# EAGLE design Emoji Board (EAGLE 7.5.0)
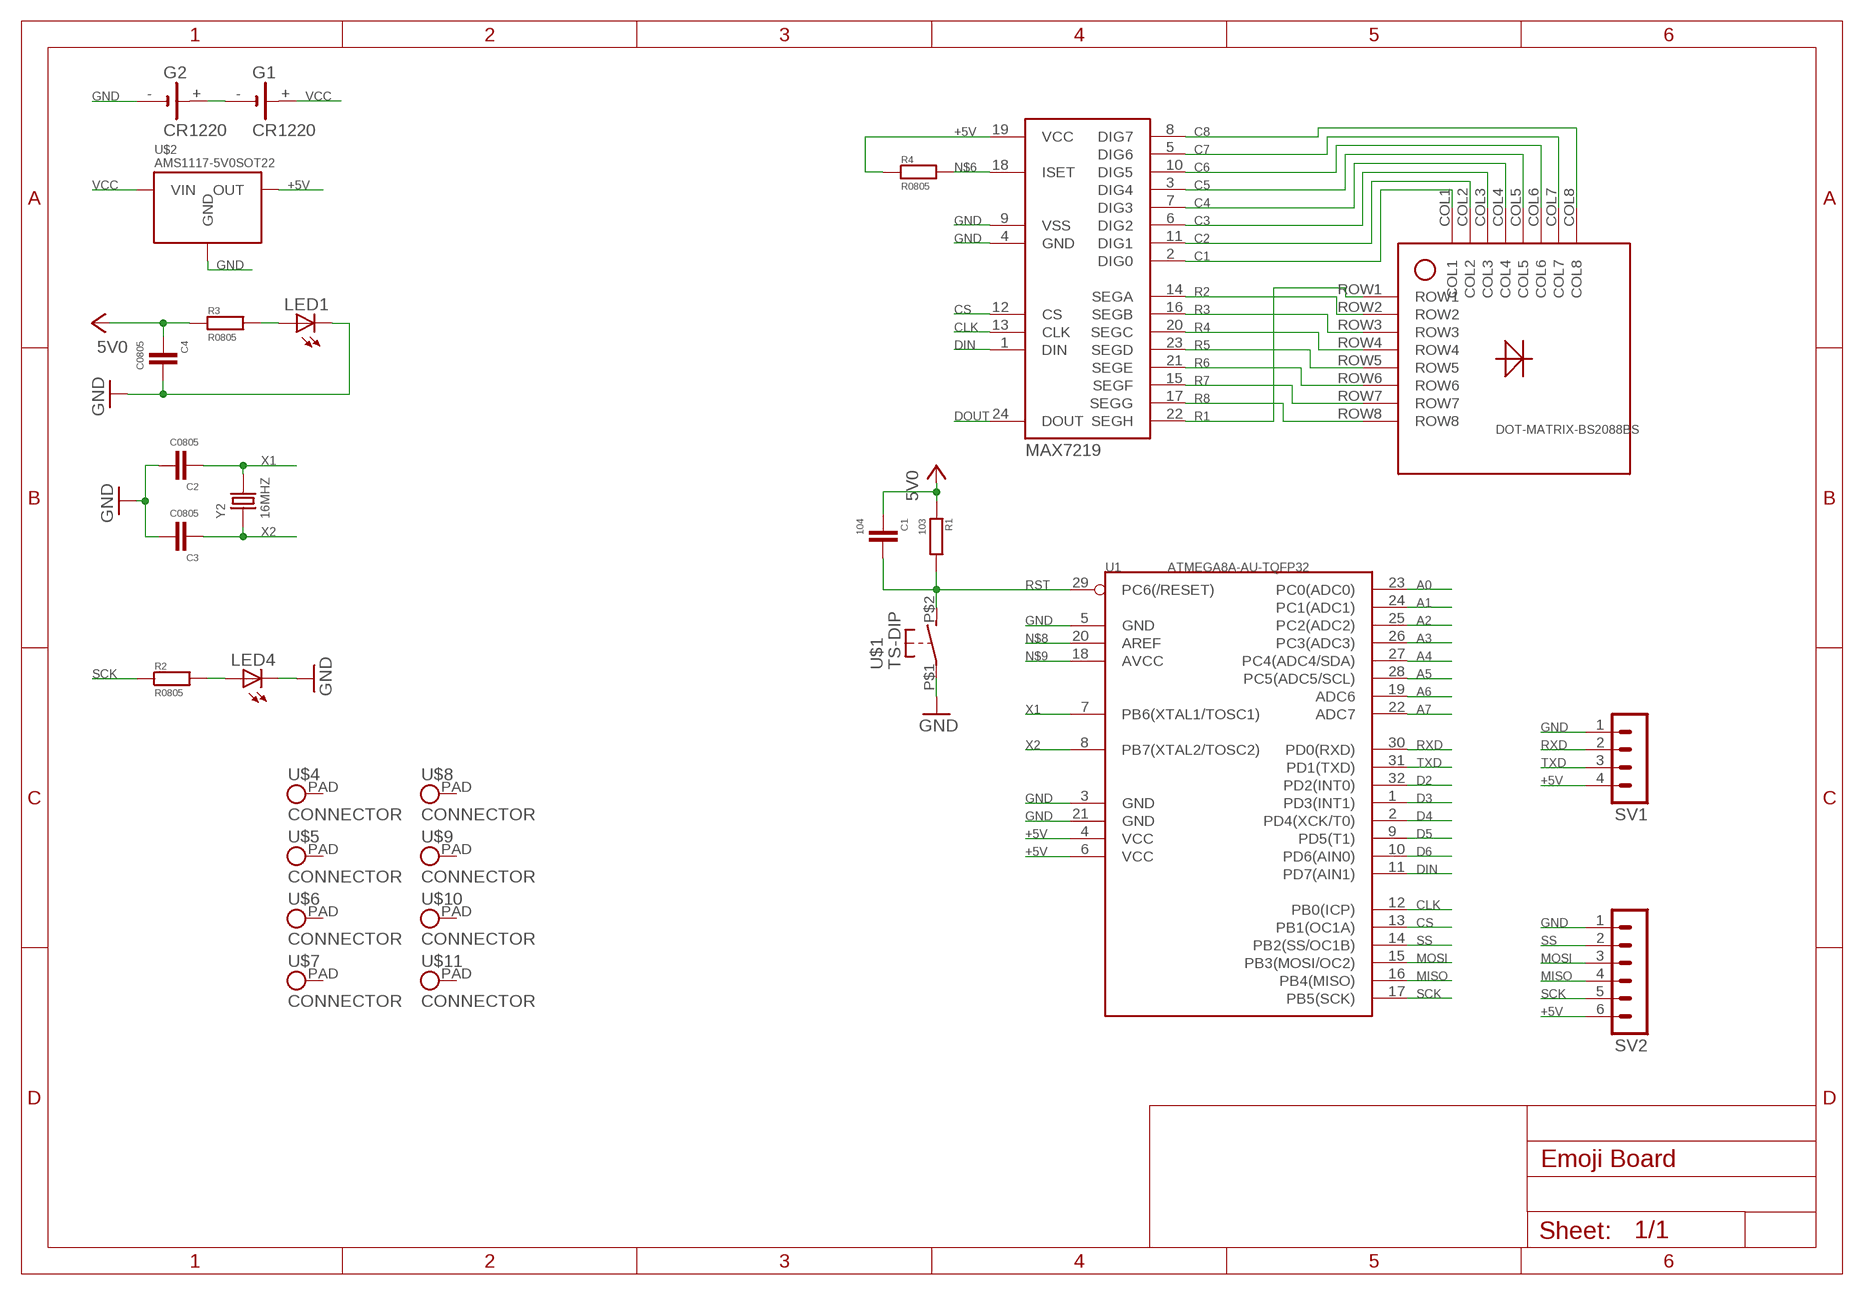
[diagram p0: schematic, sheet 1]

## Parts
C1  104  C0805  [C0805]
C2  C0805  [C0805]
C3  C0805  [C0805]
C4  C0805  [C0805]
G1  CR1220  [CR1220]
G2  CR1220  [CR1220]
LED1  LEDSML0805  [SML0805]
LED4  LEDSML0805  [SML0805]
R1  103  R0805  [R0805]
R2  R0805  [R0805]
R3  R0805  [R0805]
R4  R0805  [R0805]
SV1  MA04-1  [MA04-1]
SV2  MA06-1  [MA06-1]
U1  ATMEGA8A-AU-TQFP32  ATMEGA8A-AU  [TQFP32]
U$1  TS-DIP  [TS-DIP]
U$2  AMS1117-5V0SOT22  [SOT223]
U$3  DOT-MATRIX-BS2088BS  [2088BS]
U$4  CONNECTOR  [PAD]
U$5  CONNECTOR  [PAD]
U$6  CONNECTOR  [PAD]
U$7  CONNECTOR  [PAD]
U$8  CONNECTOR  [PAD]
U$9  CONNECTOR  [PAD]
U$10  CONNECTOR  [PAD]
U$11  CONNECTOR  [PAD]
U$12  MAX7219  [SOP24]
Y2  16MHZ  DIP-CRYSTAL-16MHZ-18PF-30PPM-40R(HC49US)  [HC49US]

## Nets
+5V: C1.2 C4.2 R1.1 R3.1 R4.1 SV1.4 SV2.6 U1.4(VCC) U1.6(VCC) U$2.OUT U$12.19(VCC) ; supply symbol labelled 5V0
A0: U1.23(PC0(ADC0))
A1: U1.24(PC1(ADC1))
A2: U1.25(PC2(ADC2))
A3: U1.26(PC3(ADC3))
A4: U1.27(PC4(ADC4/SDA))
A5: U1.28(PC5(ADC5/SCL))
A6: U1.19(ADC6)
A7: U1.22(ADC7)
C1: U$3.COL1 U$12.2(DIG0)
C2: U$3.COL2 U$12.11(DIG1)
C3: U$3.COL3 U$12.6(DIG2)
C4: U$3.COL4 U$12.7(DIG3)
C5: U$3.COL5 U$12.3(DIG4)
C6: U$3.COL6 U$12.10(DIG5)
C7: U$3.COL7 U$12.5(DIG6)
C8: U$3.COL8 U$12.8(DIG7)
CLK: U1.12(PB0(ICP)) U$12.13(CLK)
CS: U1.13(PB1(OC1A)) U$12.12(CS)
D2: U1.32(PD2(INT0))
D3: U1.1(PD3(INT1))
D4: U1.2(PD4(XCK/T0))
D5: U1.9(PD5(T1))
D6: U1.10(PD6(AIN0))
DIN: U1.11(PD7(AIN1)) U$12.1(DIN)
DOUT: U$12.24(DOUT)
GND: C2.1 C3.1 C4.1 G2.- LED1.C LED4.C SV1.1 SV2.1 U1.3(GND) U1.5(GND) U1.21(GND) U$1.P$1(P) U$2.GND U$12.4(GND) U$12.9(VSS)
MISO: SV2.4 U1.16(PB4(MISO))
MOSI: SV2.3 U1.15(PB3(MOSI/OC2))
N$1: LED4.A R2.2
N$2: G1.- G2.+
N$6: R4.2 U$12.18(ISET)
N$8: U1.20(AREF)
N$9: U1.18(AVCC)
N$10: LED1.A R3.2
R1: U$3.ROW1 U$12.22(SEGH)
R2: U$3.ROW2 U$12.14(SEGA)
R3: U$3.ROW3 U$12.16(SEGB)
R4: U$3.ROW4 U$12.20(SEGC)
R5: U$3.ROW5 U$12.23(SEGD)
R6: U$3.ROW6 U$12.21(SEGE)
R7: U$3.ROW7 U$12.15(SEGF)
R8: U$3.ROW8 U$12.17(SEGG)
RST: C1.1 R1.2 U1.29(PC6(/RESET)) U$1.P$2(S)
RXD: SV1.2 U1.30(PD0(RXD))
SCK: R2.1 SV2.5 U1.17(PB5(SCK))
SS: SV2.2 U1.14(PB2(SS/OC1B))
TXD: SV1.3 U1.31(PD1(TXD))
VCC: G1.+ U$2.VIN
X1: C2.2 U1.7(PB6(XTAL1/TOSC1)) Y2.2
X2: C3.2 U1.8(PB7(XTAL2/TOSC2)) Y2.1
Unconnected: U$4.PAD U$5.PAD U$6.PAD U$7.PAD U$8.PAD U$9.PAD U$10.PAD U$11.PAD

## Library data of the parts
C1-C4 = RCLDA:C: CAPACITOR
G1 G2 = Power:CR1220: Battery Holder, SMT, 12mm multicomp PART NO. CH291-1220LF Source: Data sheet <http://www.farnell.com/datasheets/1505860.pdf>
LED1 LED4 = Display:LED
R1-R4 = RCLDA:R: RESISTOR
SV1 = Pin-Header:MA04-1: PIN HEADER; OC_FARNELL: unknown; OC_NEWARK: unknown
SV2 = Pin-Header:MA06-1: PIN HEADER; OC_FARNELL: unknown; OC_NEWARK: unknown
U1 = Chip:ATMEGA8A-AU: 310010023; MPN: ATMEGA8A-AU
U$1 = Button:TS-DIP
U$2 = Chip:AMS1117-5V0
U$3 = Display:DOT-MATRIX-BS
U$4-U$11 = Connector:CONNECTOR
U$12 = Chip:MAX7219
Y2 = Crystal:DIP-CRYSTAL-16MHZ-18PF-30PPM-40R(HC49US): 306010014; MPN: HC-49US 16.000MHz

## Board
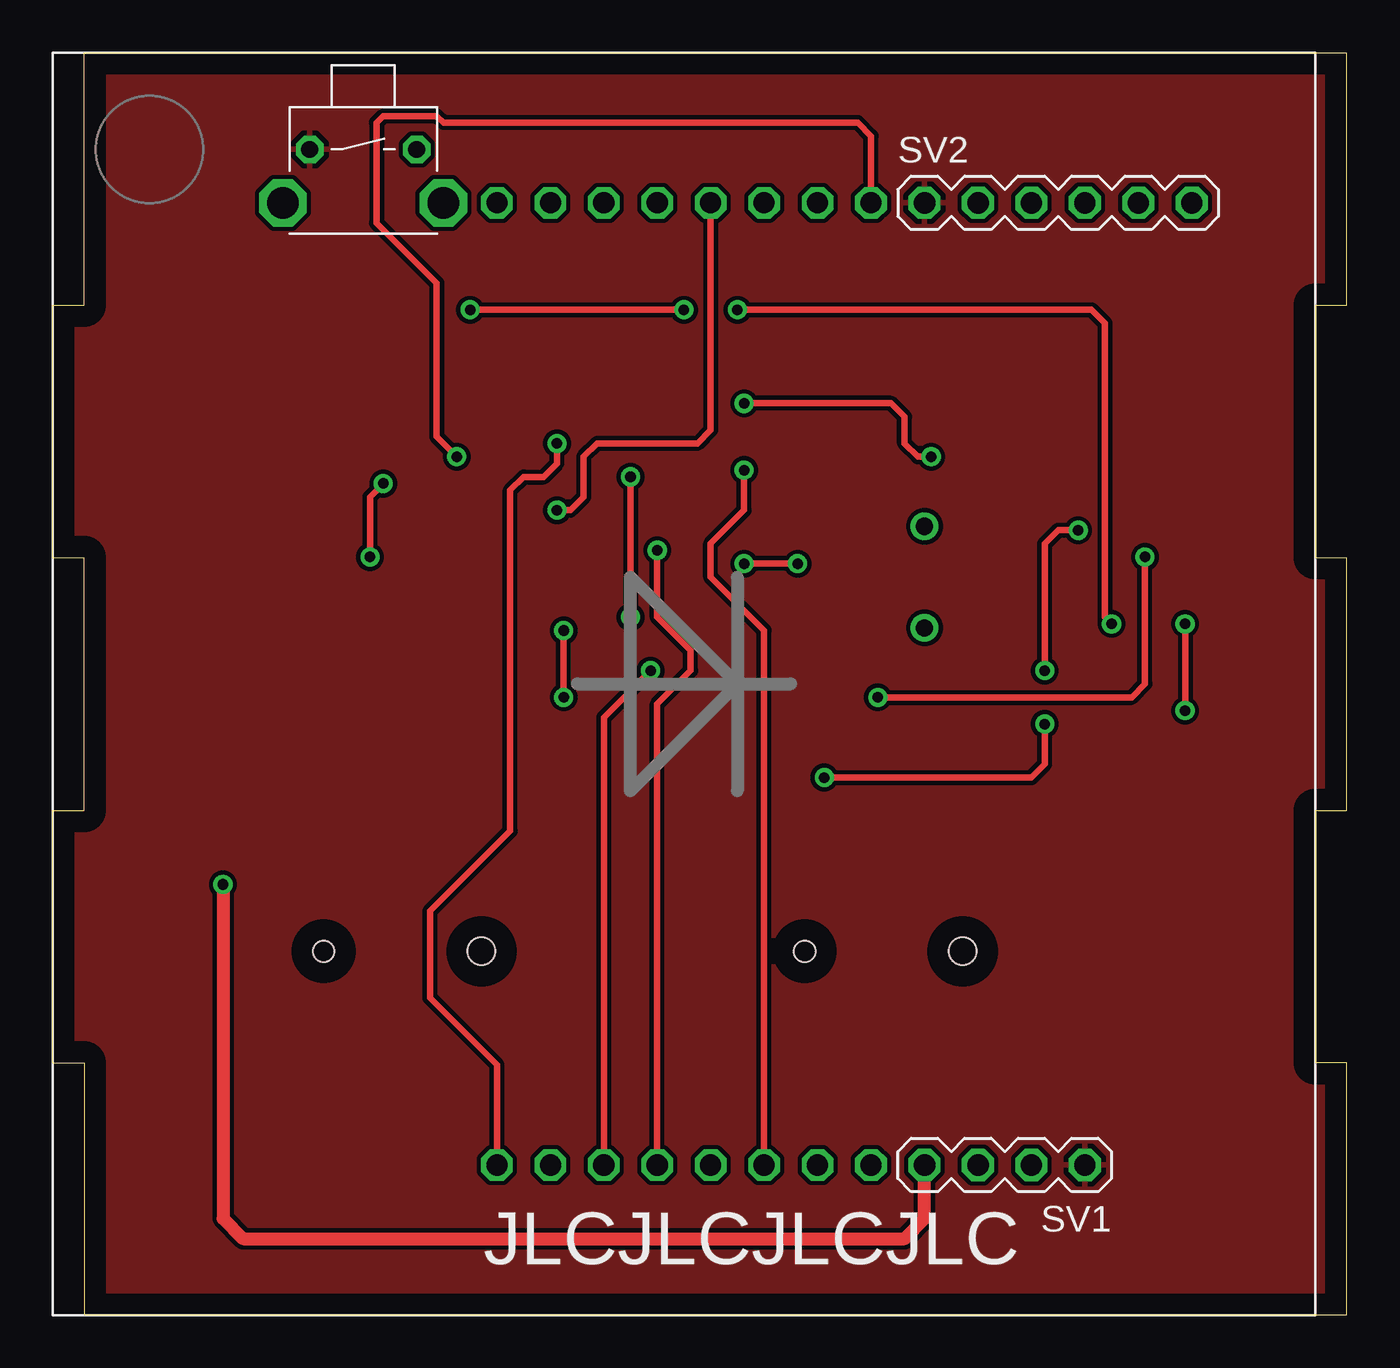
[diagram p1: board, top side]
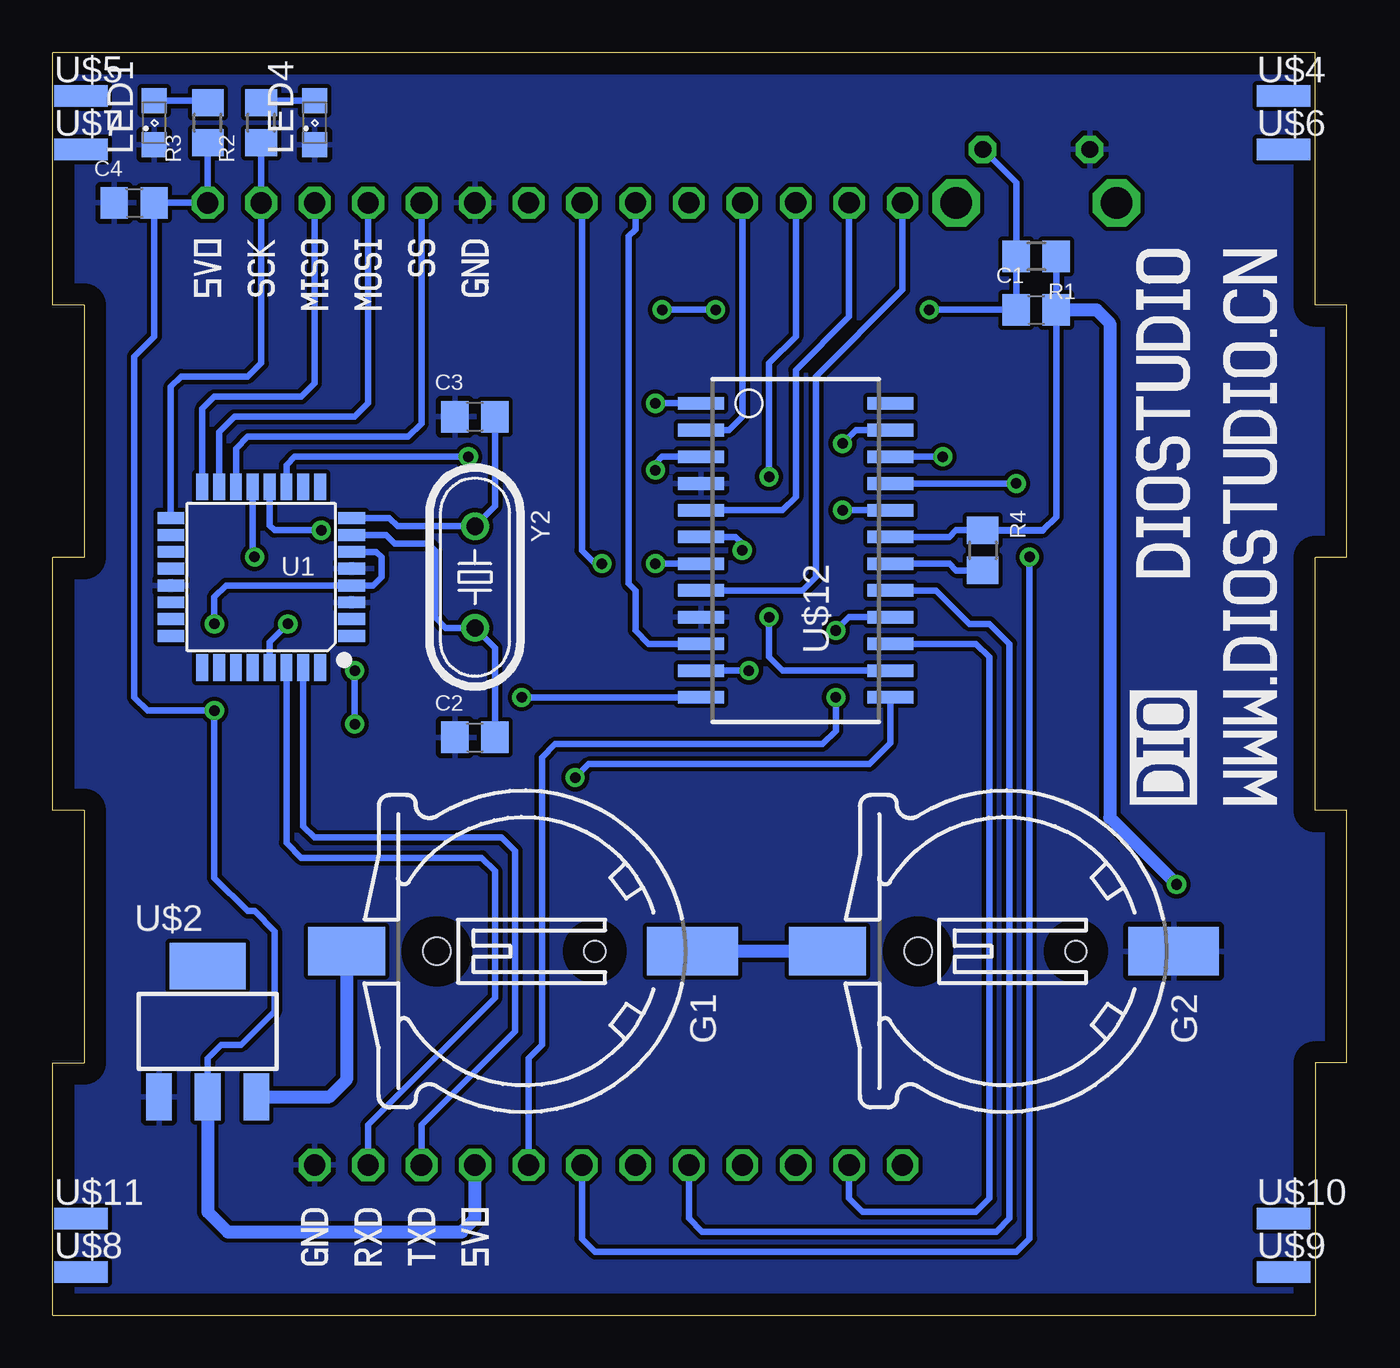
[diagram p2: board, bottom side, seen from below]

Size 61.5 x 60 mm. Coordinates in mm from the lower left corner, seen from the top.
Outline: 0,12 0,24 1.5,24 1.5,36 0,36 0,48 1.5,48 1.5,60 61.5,60 61.5,48 60,48 60,36 61.5,36 61.5,24 60,24 60,12 61.5,12 61.5,0 1.5,0 1.5,12 0,12
Copper layers (1*16): Top 0.035mm / dielectric 1.5mm / Bottom 0.035mm
Design rules "default": minimum track width 10mil, minimum drill 24mil, track to track 8mil, track to pad 8mil, pad to pad 8mil, via to via 8mil, smd to smd 8mil, copper to edge 40mil, drill to drill 8mil, minimum pad ring 10mil, minimum via ring 8mil, stop-mask expansion 4mil, vias tented up to drill 0mil, thermal gap 10mil

### Footprints (pad centres in the part's own frame; a part is rotated, then mirrored left to right if it is on the bottom)
C0805 = smd 1.3 x 1.5: 1 -0.95,0; 2 0.95,0
CR1220 = smd 2.3 x 3.66: + 0,-2.296 | smd 2.3 x 4.3: - 0,14.146 | hole 1.3: 0,2 | hole 1: 0,9.5
SML0805 = smd 1.2 x 1.2: A 1.05,0; C -1.05,0
R0805 = smd 1.3 x 1.5: 1 -0.95,0; 2 0.95,0
MA04-1 = drill 1.016 octagon: 1 -3.81,0; 2 -1.27,0; 3 1.27,0; 4 3.81,0
MA06-1 = drill 1.016 octagon: 1 -6.35,0; 2 -3.81,0; 3 -1.27,0; 4 1.27,0; 5 3.81,0; 6 6.35,0
TQFP32 = smd 1.27 x 0.559: 1 -4.293,2.8; 2 -4.293,2; 3 -4.293,1.2; 4 -4.293,0.4; 5 -4.293,-0.4; 6 -4.293,-1.2; 7 -4.293,-2; 8 -4.293,-2.8; 17 4.293,-2.8; 18 4.293,-2; 19 4.293,-1.2; 20 4.293,-0.4; 21 4.293,0.4; 22 4.293,1.2; 23 4.293,2; 24 4.293,2.8 | smd 0.559 x 1.27: 9 -2.8,-4.293; 10 -2,-4.293; 11 -1.2,-4.293; 12 -0.4,-4.293; 13 0.4,-4.293; 14 1.2,-4.293; 15 2,-4.293; 16 2.8,-4.293; 25 2.8,4.293; 26 2,4.293; 27 1.2,4.293; 28 0.4,4.293; 29 -0.4,4.293; 30 -1.2,4.293; 31 -2,4.293; 32 -2.8,4.293
TS-DIP = drill 0.8 octagon: P$1 -2.54,0; P$2 2.54,0 | drill 1.5 octagon: P$3 -3.81,-2.54; P$4 3.81,-2.54
SOT223 = smd 3.6 x 2.2: 4 0,3.099 | smd 1.219 x 2.235: GND -2.311,-3.099; OUT 0,-3.099; VIN 2.311,-3.099
2088BS = drill 1 octagon: COL1 -1.27,22.86; COL2 -3.81,-22.86; COL3 -1.27,-22.86; COL4 6.35,22.86; COL5 3.81,-22.86; COL6 3.81,22.86; COL7 -6.35,22.86; COL8 -8.89,22.86; ROW1 8.89,22.86; ROW2 -3.81,22.86; ROW3 8.89,-22.86; ROW4 1.27,22.86; ROW5 -8.89,-22.86; ROW6 6.35,-22.86; ROW7 -6.35,-22.86; ROW8 1.27,-22.86
PAD = smd 2.54 x 1.016: PAD 0,0
SOP24 = smd 0.6 x 2.2: 1 -6.985,-4.5; 2 -5.715,-4.5; 3 -4.445,-4.5; 4 -3.175,-4.5; 5 -1.905,-4.5; 6 -0.635,-4.5; 7 0.635,-4.5; 8 1.905,-4.5; 9 3.175,-4.5; 10 4.445,-4.5; 11 5.715,-4.5; 12 6.985,-4.5; 13 6.985,4.5; 14 5.715,4.5; 15 4.445,4.5; 16 3.175,4.5; 17 1.905,4.5; 18 0.635,4.5; 19 -0.635,4.5; 20 -1.905,4.5; 21 -3.175,4.5; 22 -4.445,4.5; 23 -5.715,4.5; 24 -6.985,4.5
HC49US = drill 0.813: 1 -2.413,0; 2 2.413,0

### Placement (x,y rotation side)
C1  14.76,47.78 0 bottom
C2  41.43,27.46 0 bottom
C3  41.43,42.7 0 bottom
C4  57.62,52.86 0 bottom
G1  45.24,17.3 270 bottom
G2  22.38,17.3 270 bottom
LED1  56.67,56.67 90 bottom
LED4  49.05,56.67 90 bottom
R1  14.76,50.32 180 bottom
R2  51.59,56.67 90 bottom
R3  54.13,56.67 90 bottom
R4  17.3,36.35 270 bottom
SV1  45.24,7.14 180 top
SV2  47.78,52.86 0 top
U1  51.59,35.08 180 bottom
U$1  14.76,55.4 0 top
U$2  54.13,13.49 0 bottom
U$3  30,30 0 top
U$4  3.01,57.94 0 bottom
U$5  60.16,57.94 0 bottom
U$6  3.01,55.4 0 bottom
U$7  60.16,55.4 0 bottom
U$8  60.16,2.06 0 bottom
U$9  3.01,2.06 0 bottom
U$10  3.01,4.6 0 bottom
U$11  60.16,4.6 0 bottom
U$12  26.19,36.35 270 bottom
U$13  [5V0_050]  53.5,48.41 90 bottom
U$14  [GND_050]  40.8,48.41 90 bottom
U$15  [TXD_050]  43.34,2.38 90 bottom
U$16  [RXD_050]  45.88,2.38 90 bottom
U$17  [5V0_050]  40.8,2.38 90 bottom
U$18  [GND_050]  48.41,2.38 90 bottom
U$20  [WWW.DIOSTUDIO.CN_100]  3.33,24.29 90 bottom
U$21  [LOGO_100]  7.14,24.29 90 bottom
U$22  [DIOSTUDIO_100]  7.46,35.08 90 bottom
U$23  [SCK_050]  50.95,48.41 90 bottom
U$24  [MISO_050]  48.41,47.78 90 bottom
U$25  [MOSI_050]  45.88,47.78 90 bottom
U$26  [SS_050]  43.34,49.37 90 bottom
Y2  41.43,35.08 270 bottom

### Tracks (layer width: path | path; a pad name or v marks a point on that pad's centre or on a via)
+5V  (via drill 0.5)
  Top 0.305: v53.81,32.86 v53.81,28.73
  Top 0.61: v8.09,20.48 8.09,4.6 9.05,3.65 40.48,3.65 41.43,4.6 SV1.4
  Bottom 0.305: R1.1 C1.2 | R3.1 SV2.6 C4.2 56.67,46.51 57.62,45.56 57.62,29.36 56.99,28.73 v53.81,28.73 53.81,20.79 52.23,19.2 51.91,19.2 50.95,18.25 50.95,14.44 52.54,12.86 53.5,12.86 54.13,12.22 U$2.OUT | U1.6 46.12,36.28 45.88,36.03 45.88,35.08 46.27,34.68 U1.4 53.26,34.68 53.81,34.13 v53.81,32.86 | R4.1 18.57,37.3 18.89,36.98 U$12.19 | R4.1 14.45,37.3 14.44,37.3 | C1.2 13.81,37.94 14.44,37.3 | R4.1 14.44,37.3 | C1.2
  Bottom 0.61: U$2.OUT 54.13,4.92 53.18,3.96 42.06,3.96 41.43,4.6 SV1.4 | C1.2 11.9,47.78 11.27,47.14 11.27,23.65 v8.09,20.48 | C4.2
C1
  Bottom 0.305: U$3.COL1 28.73,42.7 29.36,42.06 U$12.2
C2  (via drill 0.5)
  Top 0.305: U$3.COL2 26.19,28.41 v28.41,30.64
  Bottom 0.305: v28.41,30.64 U$12.11
C3  (via drill 0.5)
  Top 0.305: U$3.COL3 28.73,29.05 30.32,30.64 30.32,31.59 28.73,33.17 v28.73,36.35
  Bottom 0.305: v28.73,36.35 28.73,36.67 29.05,36.98 U$12.6
C4  (via drill 0.5)
  Top 0.305: v35.4,35.72 v32.86,35.72
  Bottom 0.305: U$3.COL4 36.35,36.35 35.72,35.72 v35.4,35.72 | v32.86,35.72 U$12.7
C5  (via drill 0.5)
  Top 0.305: U$3.COL5 33.81,32.54 31.27,35.08 31.27,36.67 32.86,38.26 v32.86,40.16
  Bottom 0.305: v32.86,40.16 32.86,40.48 32.54,40.8 U$12.3
C6
  Bottom 0.305: U$12.10 33.17,31.91 33.81,32.54 33.81,34.45 34.13,34.76 34.13,51.27 33.81,51.59 U$3.COL6
C7
  Bottom 0.305: U$3.COL7 23.65,47.46 26.19,44.92 26.19,38.89 26.82,38.26 U$12.5
C8
  Bottom 0.305: U$3.COL8 21.11,48.73 25.24,44.61 25.24,35.08 25.87,34.45 U$12.8
CLK  (via drill 0.5)
  Top 0.305: v36.67,25.55 46.51,25.55 47.14,26.19 v47.14,28.09 | v47.14,30.64 47.14,36.67 47.78,37.3 v48.73,37.3
  Bottom 0.305: U$12.13 21.69,27.2 22.7,26.19 36.03,26.19 v36.67,25.55 | v47.14,28.09 v47.14,30.64 | v48.73,37.3 50.95,37.3 51.19,37.54 U1.12
CS  (via drill 0.5)
  Top 0.305: v39.21,29.36 51.27,29.36 51.91,30 v51.91,36.03
  Bottom 0.305: U$12.12 v39.21,29.36 | U1.13 51.99,36.12 v51.91,36.03
DIN  (via drill 0.5)
  Top 0.305: v41.75,40.8 41.11,40.8 40.48,41.43 40.48,42.7 39.84,43.34 v32.86,43.34
  Bottom 0.305: U1.11 50.39,40.41 50,40.8 v41.75,40.8 | v32.86,43.34 U$12.1
GND
  pour Top: -0.48,-0.48 -0.48,60.48 61.75,60.48 61.75,-0.48
  pour Bottom: -0.48,-0.48 -0.48,60.48 33.81,60.48 61.75,60.48 61.75,-0.48
MISO
  Bottom 0.305: U1.16 54.39,43.08 53.81,43.65 49.69,43.65 49.05,44.29 SV2.4
MOSI
  Bottom 0.305: U1.15 53.59,41.97 52.86,42.7 47.14,42.7 46.51,43.34 SV2.3
N$1
  Bottom 0.305: LED4.A 51.49,57.72 R2.2
N$2
  Bottom 0.61: G2.+ G1.-
N$6
  Bottom 0.305: U$12.18 18.89,35.72 18.57,35.4 R4.2
N$10
  Bottom 0.305: LED1.A 54.23,57.72 R3.2
R1  (via drill 0.5)
  Top 0.305: U$3.ROW1 38.89,56.03 38.26,56.67 18.57,56.67 18.25,56.99 15.71,56.99 15.39,56.67 15.39,51.91 18.25,49.05 18.25,41.75 v19.2,40.8
  Bottom 0.305: v19.2,40.8 U$12.22
R2  (via drill 0.5)
  Top 0.305: v27.46,39.84 v27.46,33.17
  Bottom 0.305: U$3.ROW2 26.19,46.51 27.46,45.24 v27.46,39.84 | v27.46,33.17 27.46,31.27 26.82,30.64 U$12.14
R3  (via drill 0.5)
  Top 0.305: v24.29,29.36 v24.29,32.54
  Bottom 0.305: U$3.ROW3 38.89,12.22 38.26,12.86 38.26,26.51 37.62,27.14 24.92,27.14 24.29,27.78 v24.29,29.36 | v24.29,32.54 23.65,33.17 U$12.16
R4  (via drill 0.5)
  Top 0.305: U$3.ROW4 31.27,42.06 30.64,41.43 25.87,41.43 25.24,40.8 25.24,38.89 24.6,38.26 v23.97,38.26
  Bottom 0.305: v23.97,38.26 U$12.20
R5  (via drill 0.5)
  Top 0.305: U$3.ROW5 21.11,11.9 17.94,15.08 17.94,19.2 21.74,23.02 21.74,39.21 22.38,39.84 23.33,39.84 23.97,40.48 v23.97,41.43
  Bottom 0.305: v23.97,41.43 23.33,42.06 U$12.23
R6  (via drill 0.5)
  Top 0.305: v15.08,36.03 15.08,38.89 v15.71,39.52
  Bottom 0.305: U$3.ROW6 36.35,3.65 35.72,3.01 15.71,3.01 15.08,3.65 v15.08,36.03 | v15.71,39.52 U$12.21
R7
  Bottom 0.305: U$3.ROW7 23.65,5.55 23.02,4.92 17.62,4.92 16.98,5.55 16.98,31.27 17.62,31.91 U$12.15
R8
  Bottom 0.305: U$3.ROW8 31.27,4.6 30.64,3.96 16.66,3.96 16.03,4.6 16.03,31.91 16.98,32.86 17.94,32.86 19.52,34.45 U$12.17
RST  (via drill 0.5)
  Top 0.305: v19.84,47.78 v30,47.78 | v32.54,47.78 49.37,47.78 50,47.14 50,33.17 v50.32,32.86
  Bottom 0.305: U$1.P$2 15.71,53.81 R1.2 C1.1 v19.84,47.78 | v30,47.78 v32.54,47.78 | U1.29 51.19,31.99 50.64,32.54 v50.32,32.86
RXD
  Bottom 0.305: U1.30 50.39,22.45 49.69,21.74 41.11,21.74 40.48,21.11 40.48,15.08 46.51,9.05 SV1.2
SCK
  Bottom 0.305: R2.1 SV2.5 51.59,45.24 52.23,44.61 55.4,44.61 55.88,44.12 U1.17
SS
  Bottom 0.305: U1.14 52.79,41.18 52.23,41.75 44.61,41.75 43.97,42.38 SV2.2
TXD
  Bottom 0.305: U1.31 49.59,23.24 49.05,22.7 40.16,22.7 39.52,22.06 39.52,13.49 43.97,9.05 SV1.3
VCC
  Bottom 0.61: G1.+ 47.53,11.2 48.34,10.39 U$2.VIN
X1
  Bottom 0.305: C2.2 40.48,31.72 Y2.2 42.83,32.67 43.34,33.17 43.34,36.35 43.65,36.67 45.24,36.67 45.65,37.08 U1.7
X2
  Bottom 0.305: C3.2 40.48,38.44 Y2.1 45.11,37.49 45.5,37.88 U1.8

### Text on the board
tPlace: JLCJLCJLCJLC